# Altium schematic sheet 0_Architecture.SchDoc: OBDH Hardware Archictecture
size A4; DrawnBy: Sara Vega/Matheus Frata; Revision: V2.1; SheetNumber: 0; SheetTotal: 7
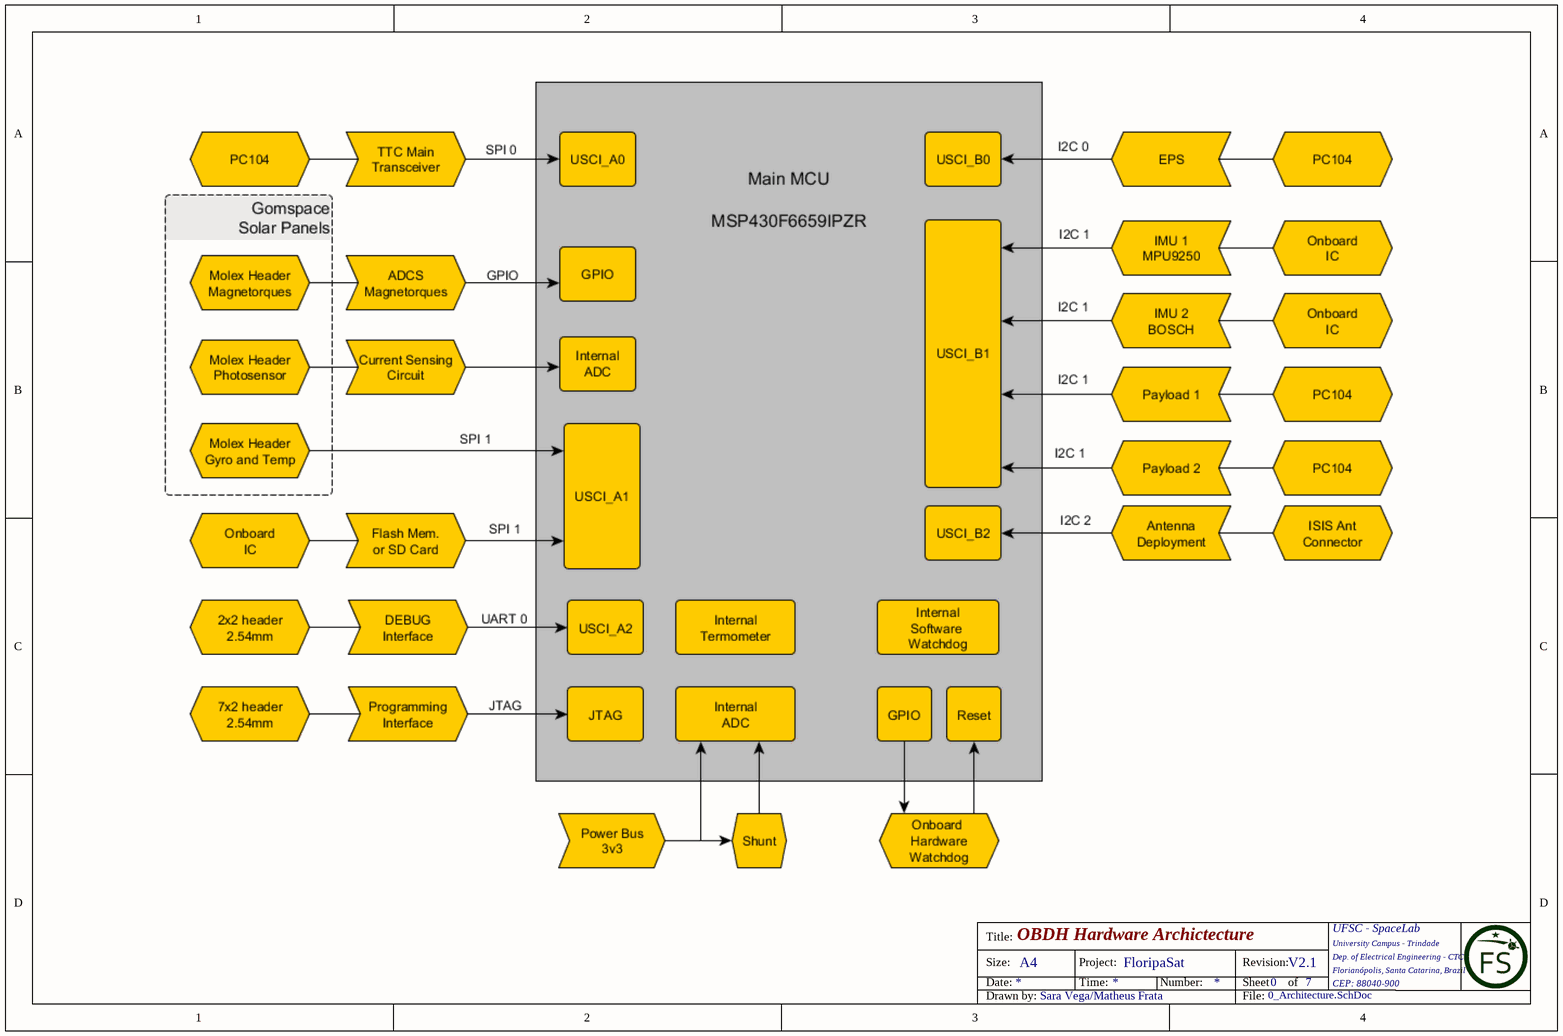
[diagram p0: 0_Architecture.SchDoc]

## Notes on the sheet
- Title:
- Size:
- Date:
- A4
- Project:
- Time:
- FloripaSat
- Number:
- Revision:
- Sheet
- of
- UFSC - SpaceLab
- University Campus - Trindade
- Dep. of Electrical Engineering - CTC
- Florianópolis, Santa Catarina, Brazil
- CEP: 88040-900
- Drawn by:
- File: